# Altium schematic sheet POWER_SUPPLY.SchDoc: Power Supply
size B; Engineer: M. Jones; Organization: Michael Jones; DocumentNumber: 2; Revision: RA.1; SheetNumber: 2; SheetTotal: 7
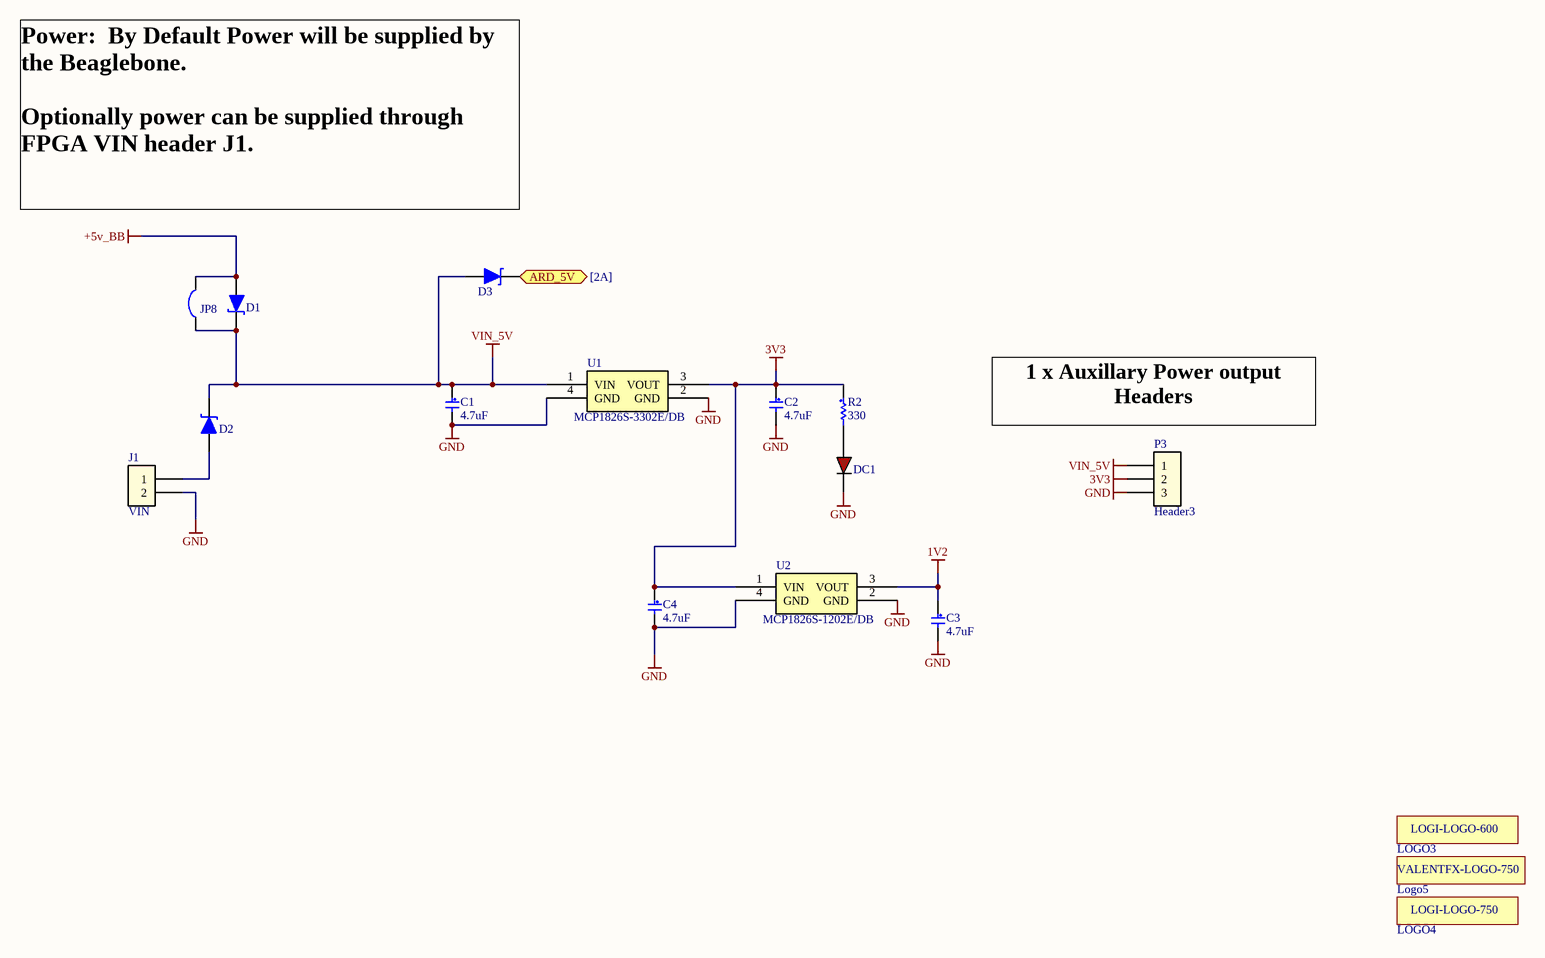
[diagram p0: POWER_SUPPLY.SchDoc]

## Parts
C1  4.7uF  [C0603 - Marked]
C2  4.7uF  [C0603 - Marked]
C3  4.7uF  [C0603 - Marked]
C4  4.7uF  [C0603 - Marked]
D1  RB161M-20TR  [SOD-123]  (value not drawn)
D2  RB161M-20TR  [SOD-123]  (value not drawn)
D3  RB161M-20TR  [SOD-123]  (value not drawn)
DC1  598-8010-107F  [LED_0603 - RED]  (value not drawn)
J1  VIN  [HEADER_2_40_100 THRU SIP]  (no BOM)
JP8  Solder Jumper  [SOLDER_JUMPER]  (value not drawn)  (no BOM)
LOGO3  LOGI-600  [LOGI-600-SILK]  (value not drawn)  (no BOM)
LOGO4  LOGI-750  [LOGI-750-SILK-NB]  (value not drawn)  (no BOM)
Logo5  Valent Logo 750  [VALENTFX_750-SolderMask]  (value not drawn)  (no BOM)
P3  Header3  [HEADER_3_40_100 THRU SIP]  (no BOM)
R2  330  [R0603]
U1  MCP1826S-3302E/DB  [SOT223]
U2  MCP1826S-1202E/DB  [SOT223]

## Ports
ARD_5V (see [2A])

## Nets
1V2: C3.1 U2.3(VOUT)
3V3: C2.1 C4.1 P3.2 R2.1 U1.3(VOUT) U2.1(VIN)
+5v_BB: D1.2(A) JP8.1
GND: C1.2 C2.2 C3.2 C4.2 DC1.C J1.2 P3.3 U1.2(GND) U1.4(GND) U2.2(GND) U2.4(GND)
VIN_5V: C1.1 D1.1(C) D2.1(C) D3.2(A) JP8.2 P3.1 U1.1(VIN)
ARD_5V: D3.1(C) ; port ARD_5V
NetD2_2: D2.2(A) J1.1
NetDC1_A: DC1.A R2.2

## Notes on the sheet
- Power:  By Default Power will be supplied by the Beaglebone.
  Optionally power can be supplied through FPGA VIN header J1.
- (near P3) 1 x Auxillary Power output Headers
- Title
- Revision:
- Sheet
- of
- Date:
- Engineer:
- (in symbol LOGI-600) LOGI-LOGO-600
- (in symbol LOGI-750) LOGI-LOGO-750
- (in symbol Valent Logo 750) VALENTFX-LOGO-750

## Library data of the parts
C1-C4 = C0603 - GRM188R60J475KE19D: 4.7uF 6.3volts X5R 10% (MLCC) - SMD/SMT 0603; Manufacturer: Murata Electronics North America; Accept Compatible Replacement Part: Yes; Capacitance: 4.7µF; Voltage - Rated: 6.3V; Value: 4.7uF; Supplier 1: Digi-Key; Supplier Part Number 1: 490-3297-1-ND; Manufacturer Part Number: GRM188R60J475KE19D; RoHS: RoHS Compliant; Category: Capacitors; Stock 1: 614848; Pricing 1: 1=0.19, 10=0.132, 50=0.076, 100=0.0627, 250=0.05284, 500=0.04426, 1000=0.03633 (USD); Tolerance: ±10%; Package / Case: 0603 (1608 Metric); Packaging: Cut Tape (CT); ComponentLink1URL: http://search.murata.co.jp/Ceramy/image/img/PDF/ENG/GRM188R60J475KE19.pdf; ComponentLink1Description: http://search.murata.co.jp/Ceramy/image/img/PDF/ENG/GRM188R60J475KE19.pdf; Temperature Coefficient: X5R; Mounting Type: Surface Mount, MLCC; Operating Temperature: -55°C ~ 85°C; Applications: General Purpose; Ratings: -; Size / Dimension: 0.063" L x 0.031" W (1.60mm x 0.80mm); Height - Seated (Max): -; Thickness (Max): 0.035" (0.90mm); Lead Spacing: -; Features: -; Lead Style: -
D1-D3 = RB161M-20TR: DIODE SCHOTTKY 25V 1A SOD123; Source Part Number: RB161M-20CT-ND; Manufacturer: Diodes Inc; Manufacturer Part Number: Rohm Semiconductor; Voltage - Forward (Vf) (Max) @ If: 350mV @ 1A; Voltage - DC Reverse (Vr) (Max): 20V; Current - Reverse Leakage @ Vr: 700µA @ 20V; Speed: Fast Recovery =< 500ns, > 200mA (Io); Source: Digikey; Value: RB161M-20TR; Supplier 1: Digi-Key; RoHS: RoHS Compliant; Category: Discrete Semiconductor Products; Stock 1: 29589; Pricing 1: 1=0.58, 25=0.4044, 100=0.3465, 250=0.29924, 500=0.25726, 1000=0.1995 (USD); Current - Average Rectified (Io): 1A; Diode Type: Schottky; Reverse Recovery Time (trr): -; Capacitance @ Vr, F: -; Mounting Type: Surface Mount; Package / Case: SOD-123F; Supplier Device Package: PMDU; Packaging: Cut Tape (CT); ComponentLink1URL: http://www.rohm.com/products/databook/di/pdf/rb161m-20.pdf; ComponentLink1Description: http://www.rohm.com/products/databook/di/pdf/rb161m-20.pdf; Supplier Part Number 1: RB161M-20CT-ND
DC1 = LED0603 - 598-8010-107F: LED ALINGAP RED CLEAR 0603 SMD; Manufacturer: Dialight; Current - Test: 20mA; Wavelength - Dominant: 635nm; Millicandela Rating: 40mcd; Voltage - Forward (Vf) Typ: 2.2V; Lens Style/Size: Rectangle with Flat Top, 1.1mm x 0.8mm; Viewing Angle: 140°; Accept Replacement: YES - Water Clear; Supplier 1: Digi-Key; Manufacturer Part Number: 598-8010-107F; RoHS: RoHS Compliant; Category: Optoelectronics; Stock 1: 37578; Pricing 1: 1=0.45, 10=0.33, 25=0.264, 100=0.1749, 250=0.1452, 500=0.1056, 1000=0.0825 (USD); Color: Red; Luminous Flux @ Current - Test: -; Wavelength - Peak: -; Lens Type: Clear; Size / Dimension: 1.60mm L x 0.80mm W; Height: 0.70mm; Package / Case: 0603 (1608 Metric); Mounting Type: Surface Mount; Packaging: Digi-Reel®; ComponentLink1URL: http://media.digikey.com/pdf/Data%20Sheets/Dialight%20PDFs/598_Series_0603_Pkg.pdf; ComponentLink1Description: http://media.digikey.com/pdf/Data%20Sheets/Dialight%20PDFs/598_Series_0603_Pkg.pdf; Supplier Part Number 1: 350-2029-6-ND
J1 = Header2: Header 2 pin
JP8 = Solder Jumper: Solder/Configuration Jumper; Manufacturer: n/a; Manufacturer Part Number: n/a; Source: n/a; Source Part Number: n/a; ROHS Certificate: n/a
P3 = Header3: Header  pin
R2 = R0603 - ERJ-3GEYJ331V: Thick Film Resistors - SMD 0603 330ohms 5% Tol; Manufacturer: Panasonic; Temperature Coefficient: 200 PPM / C; Power Rating: 100 mW; Voltage Rating: 75 V; Manufacturer Part Number: ERJ-3GEYJ331V; Value: 330; Supplier 1: Mouser; Supplier Part Number 1: 667-ERJ-3GEYJ331V; RoHS: RoHS Compliant By Exemption; Category: Thick Film Resistors - SMD; Stock 1: 131470; Pricing 1: 1=0.108, 10=0.012, 100=0.005, 1000=0.004, 5000=0.003 (AUD); Tolerance: 5 %; Packaging: Reel; Package / Case: 0603 (1608 metric); ComponentLink1URL: http://www.mouser.com/ds/2/315/AOA0000CE1-37422.pdf; ComponentLink1Description: http://www.mouser.com/ds/2/315/AOA0000CE1-37422.pdf; Dimensions: 0.8 mm W x 1.6 mm L x 0.45 mm H; Operating Temperature Range: - 55 C to + 155 C; Product: Thick Film Resistors SMD; Resistance: 330 Ohms; Series: ERJ; Termination Style: SMD/SMT; Case Code - in: 0603; Case Code - mm: 1608; Standard Pack Qty: 5000; RoHS - Mouser: E; Minimum Order Quantity: 1; Reeling: True
U1 = REG - MCP1826S-3302E/DB: LDO REG 1A 3.3V SOT223-3; Manufacturer: Microchip Technology; Regulator Topology: Positive Fixed; Voltage - Input: Up to 6V; Voltage - Dropout (Typical): 0.25V @ 1A; Number of Regulators: 1; Current - Output: 1A (Min); Value: MCP1826S-3302E/DB; Supplier 1: Digi-Key; Supplier Part Number 1: MCP1826S-3302E/DB-ND; Manufacturer Part Number: MCP1826S-3302E/DB; RoHS: RoHS Compliant; Category: Integrated Circuits (ICs); Stock 1: 2041; Pricing 1: 1=0.74, 10=0.68, 25=0.57, 100=0.52 (USD); Voltage - Output: 3.3V; Current - Limit (Min): -; Operating Temperature: -40°C ~ 125°C; Mounting Type: Surface Mount; Package / Case: TO-261-4, TO-261AA; Supplier Device Package: SOT-223-3; Packaging: Tube; ComponentLink1URL: http://ww1.microchip.com/downloads/en/DeviceDoc/22057a.pdf; ComponentLink1Description: http://ww1.microchip.com/downloads/en/DeviceDoc/22057a.pdf
U2 = MCP1826S-1202E/DB: IC LDO REG 1A 1.2V SOT223-3; Manufacturer: Microchip Technology; Regulator Topology: Positive Fixed; Voltage - Input: Up to 6V; Voltage - Dropout (Typical): 0.25V @ 1A; Number of Regulators: 1; Current - Output: 1A (Min); Value: MCP1826S-1202E/DB; Supplier 1: Digi-Key; Supplier Part Number 1: MCP1826S-1202E/DB-ND; Manufacturer Part Number: MCP1826S-1202E/DB; RoHS: RoHS Compliant; Category: Integrated Circuits (ICs); Stock 1: 2041; Pricing 1: 1=0.74, 10=0.68, 25=0.57, 100=0.52 (USD); Voltage - Output: 1.2V; Current - Limit (Min): -; Operating Temperature: -40°C ~ 125°C; Mounting Type: Surface Mount; Package / Case: TO-261-4, TO-261AA; Supplier Device Package: SOT-223-3; Packaging: Tube; ComponentLink1URL: http://ww1.microchip.com/downloads/en/DeviceDoc/22057a.pdf; ComponentLink1Description: http://ww1.microchip.com/downloads/en/DeviceDoc/22057a.pdf